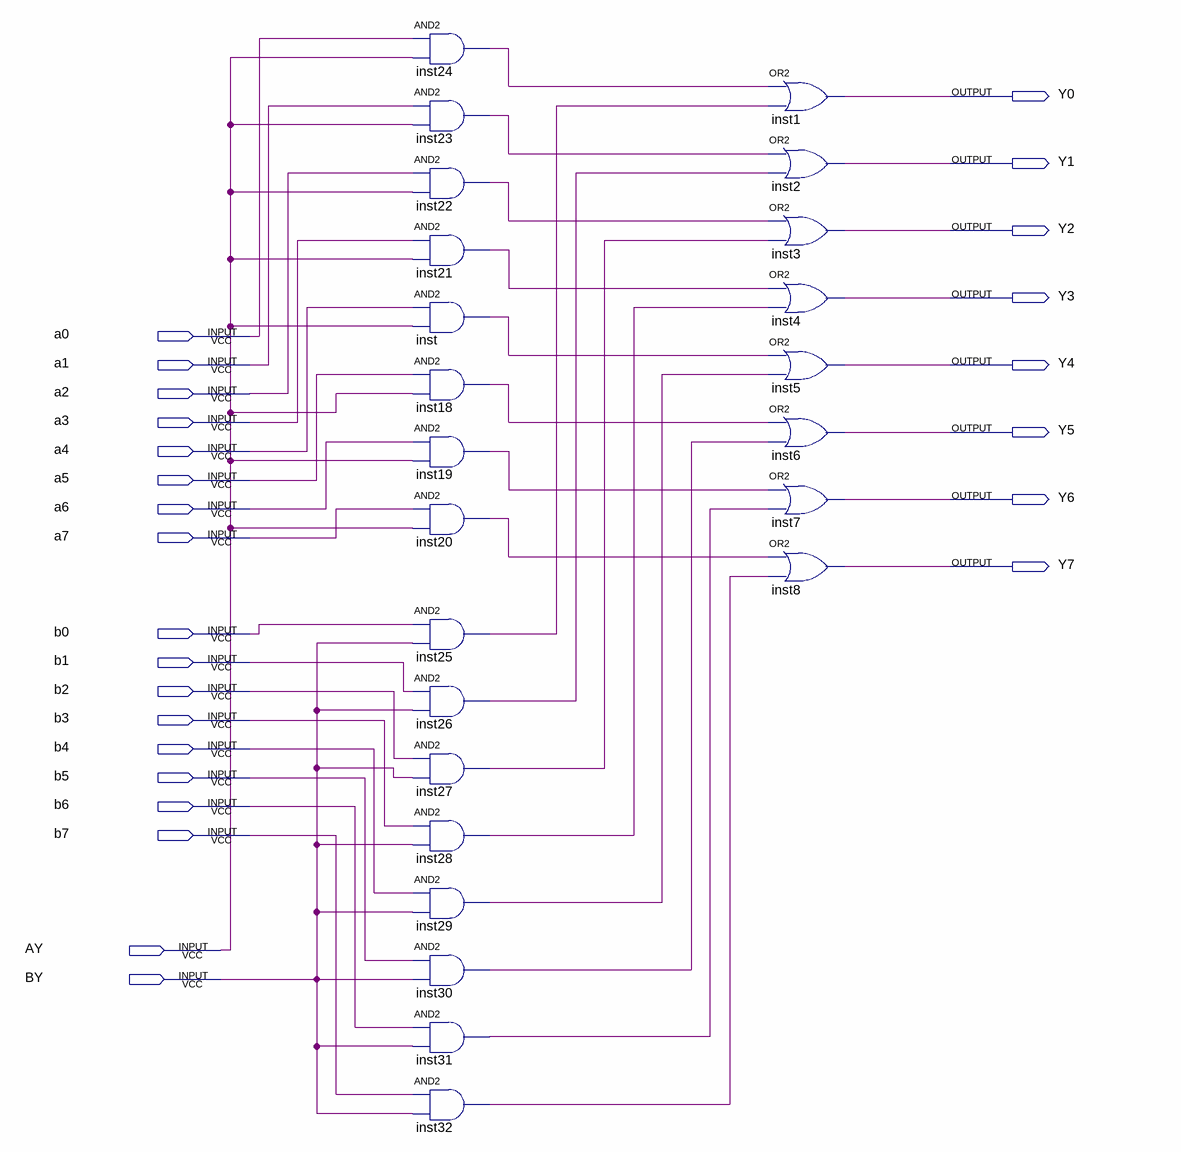
[diagram p0: schematic sheet]
// Quartus schematic double_selector_8b.bdf as structural Verilog: 24 symbols, 26 pins
module double_selector_8b (
  input  a0,
  input  a1,
  input  a2,
  input  a3,
  input  a4,
  input  a5,
  input  a6,
  input  a7,
  input  b0,
  input  b1,
  input  b2,
  input  b3,
  input  b4,
  input  b5,
  input  b6,
  input  b7,
  input  AY,
  input  BY,
  output Y0,
  output Y1,
  output Y2,
  output Y3,
  output Y4,
  output Y5,
  output Y6,
  output Y7
);

  wire inst18_out, inst19_out, inst20_out, inst21_out, inst22_out, inst23_out, inst24_out, inst25_out,
       inst26_out, inst27_out, inst28_out, inst29_out, inst30_out, inst31_out, inst32_out, inst_out;

  and inst24 (inst24_out, a0, AY);
  and inst23 (inst23_out, a1, AY);
  and inst22 (inst22_out, a2, AY);
  and inst21 (inst21_out, a3, AY);
  and inst (inst_out, a4, AY);
  and inst18 (inst18_out, a5, AY);
  and inst19 (inst19_out, a6, AY);
  and inst20 (inst20_out, a7, AY);
  and inst25 (inst25_out, b0, BY);
  and inst26 (inst26_out, b1, BY);
  and inst27 (inst27_out, b2, BY);
  and inst28 (inst28_out, b3, BY);
  and inst29 (inst29_out, b4, BY);
  and inst30 (inst30_out, b5, BY);
  and inst31 (inst31_out, b6, BY);
  and inst32 (inst32_out, b7, BY);
  or inst1 (Y0, inst24_out, inst25_out);
  or inst2 (Y1, inst23_out, inst26_out);
  or inst3 (Y2, inst22_out, inst27_out);
  or inst4 (Y3, inst21_out, inst28_out);
  or inst5 (Y4, inst_out, inst29_out);
  or inst6 (Y5, inst18_out, inst30_out);
  or inst7 (Y6, inst19_out, inst31_out);
  or inst8 (Y7, inst20_out, inst32_out);
endmodule
